# Altium schematic sheet Baseband.SchDoc
size B; SheetNumber: 2; SheetTotal: 5
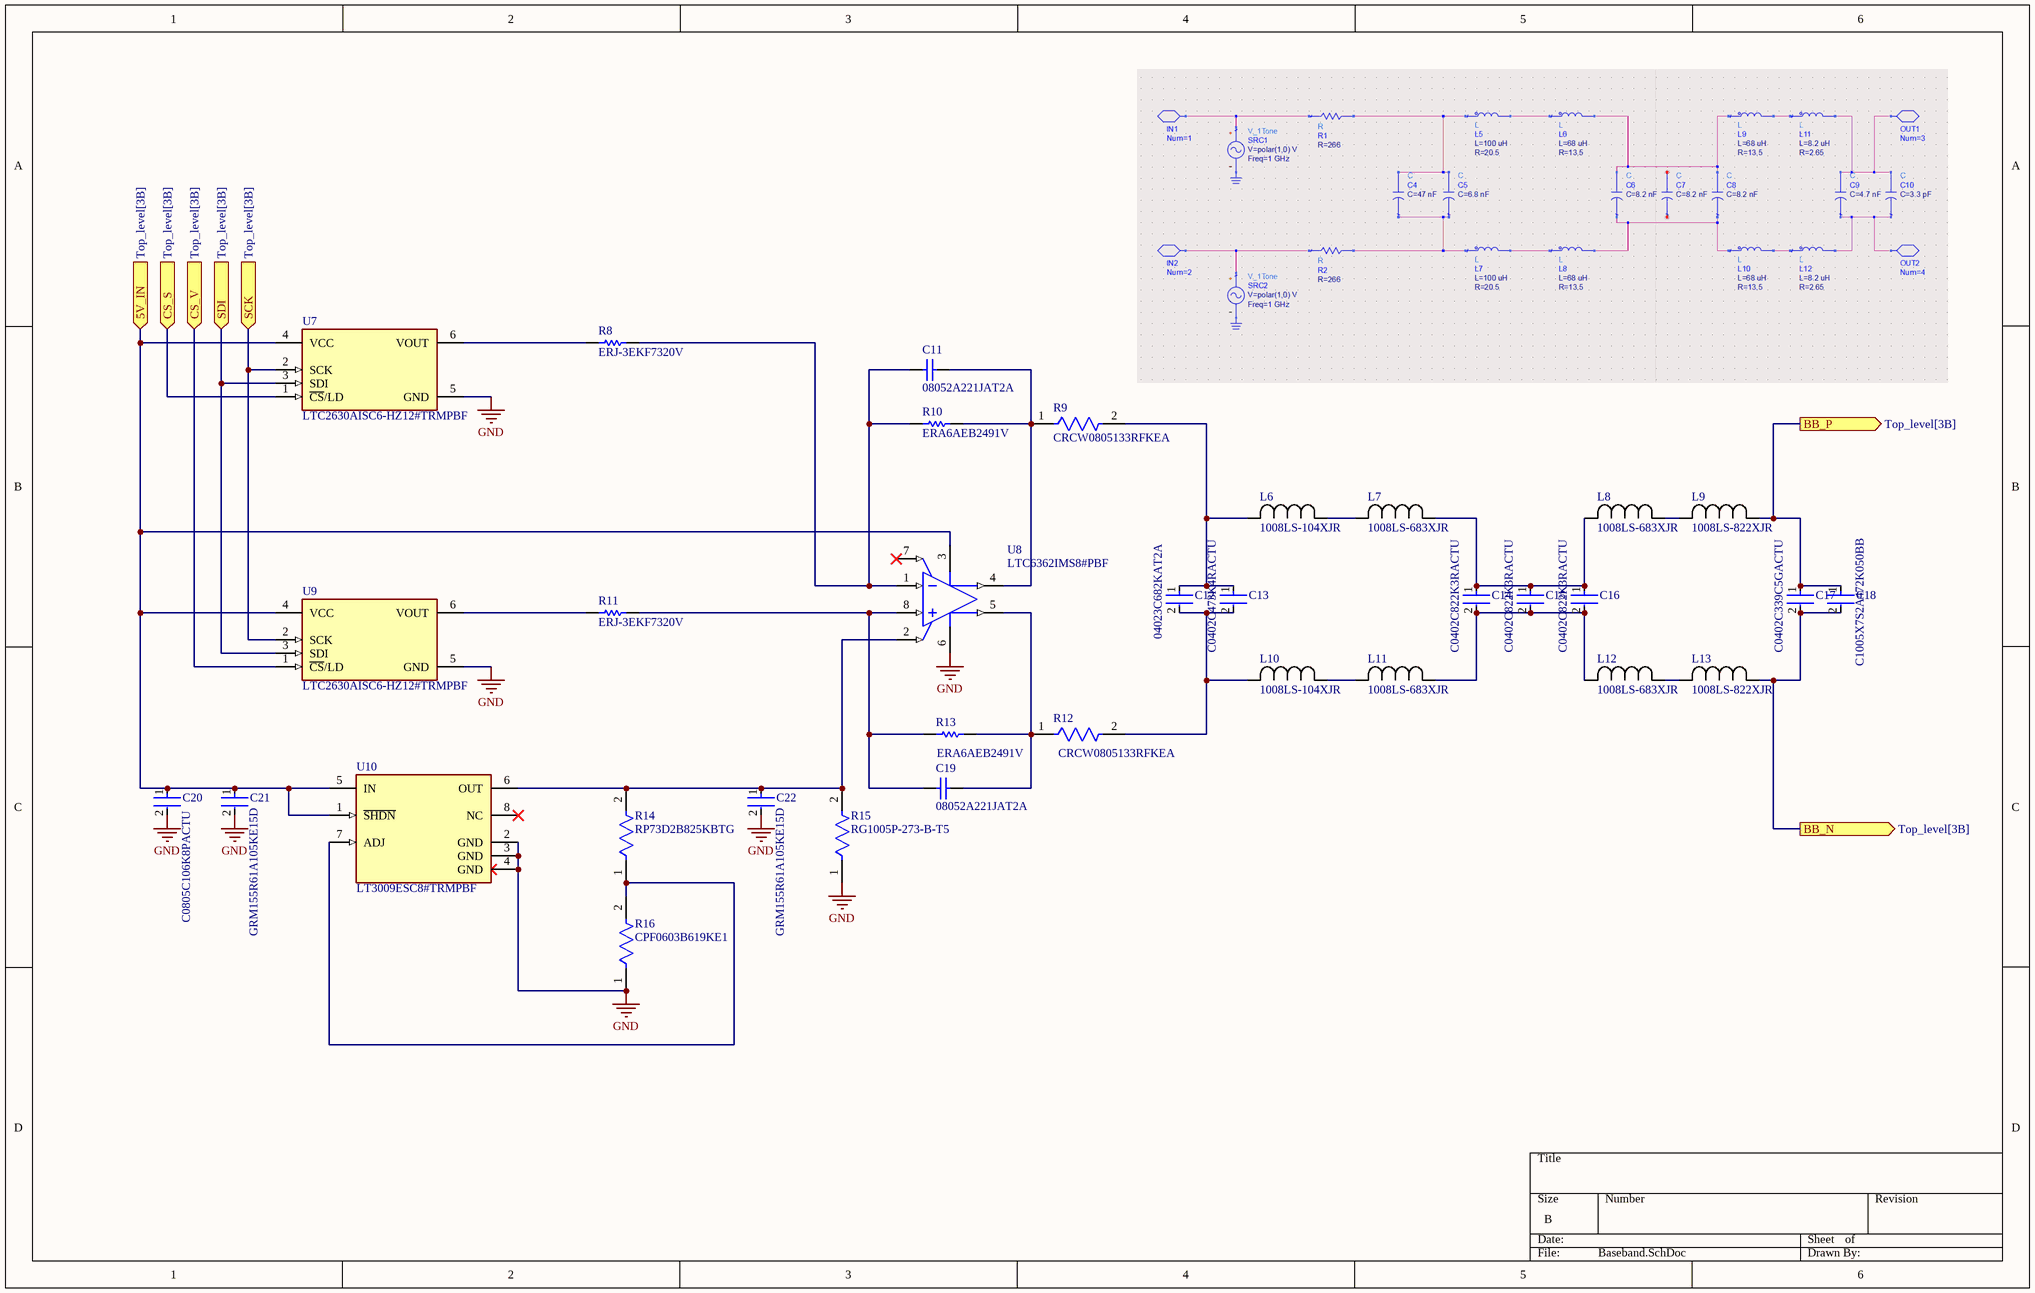
[diagram p0: Baseband.SchDoc]

## Parts
C11  08052A221JAT2A  [CAPC2013X140X50LL20T25]
C12  04023C682KAT2A  [FP-0402-L_1_0_1-W_0_5_0_1-IPC_A]
C13  C0402C473K4RACTU  [FP-C0402-BB-MFG]
C14  C0402C822K3RACTU  [FP-C0402-BB-MFG]
C15  C0402C822K3RACTU  [FP-C0402-BB-MFG]
C16  C0402C822K3RACTU  [FP-C0402-BB-MFG]
C17  C1005X7S2A472K050BB  [FP-C1005-050-0_05-IPC_C]
C18  C0402C339C5GACTU  [FP-C0402-BB-MFG]
C19  08052A221JAT2A  [CAPC2013X140X50LL20T25]
C20  C0805C106K8PACTU  [FP-C0805C-DG-MFG]
C21  GRM155R61A105KE15D  [FP-GRM15-0_1-MFG]
C22  GRM155R61A105KE15D  [FP-GRM15-0_1-MFG]
L6  1008LS-104XJR  [IND_1008LS]
L7  1008LS-683XJR  [IND_1008LS]
L8  1008LS-683XJR  [IND_1008LS]
L9  1008LS-822XJR  [IND_1008LS]
L10  1008LS-104XJR  [IND_1008LS]
L11  1008LS-683XJR  [IND_1008LS]
L12  1008LS-683XJR  [IND_1008LS]
L13  1008LS-822XJR  [IND_1008LS]
R8  ERJ-3EKF7320V  [RESC1608X55X30LL15T15]
R9  CRCW0805133RFKEA  [FP-CRCW0805-e3-IPC_C]
R10  ERA6AEB2491V  [RESC2013X60X40LL20T25]
R11  ERJ-3EKF7320V  [RESC1608X55X30LL15T15]
R12  CRCW0805133RFKEA  [FP-CRCW0805-e3-IPC_C]
R13  ERA6AEB2491V  [RESC2013X60X40LL20T25]
R14  RP73D2B825KBTG  [FP-RP732B-MFG]
R15  RG1005P-273-B-T5  [FP-RG1005-IPC_B]
R16  CPF0603B619KE1  [FP-CPF0603-MFG]
U7  LTC2630AISC6-HZ12#TRMPBF  [FP-SC6-6-05-08-1638-IPC_A]
U8  LTC6362IMS8#PBF  [LT-MS8-8_L]
U9  LTC2630AISC6-HZ12#TRMPBF  [FP-SC6-6-05-08-1638-IPC_A]
U10  LT3009ESC8#TRMPBF  [FP-SC8-8-05-08-1639-MFG]

## Ports
5V_IN (in, see Top_level[3B]), BB_N (out, see Top_level[3B]), BB_P (out, see Top_level[3B]), CS_S (in, see Top_level[3B]), CS_V (in, see Top_level[3B]), SCK (in, see Top_level[3B]), SDI (in, see Top_level[3B])

## Nets
GND: C20.2 C21.2 C22.2 R15.1 R16.1 U7.5(GND) U8.6(V-) U9.5(GND) U10.2(GND) U10.3(GND) U10.4(GND)
5V_IN: C20.1 C21.1 U7.4(VCC) U8.3(V+) U9.4(VCC) U10.1(~{SHDN}) U10.5(IN) ; port 5V_IN
BB_N: C17.2 C18.2 L13.1 ; port BB_N
BB_P: C17.1 C18.1 L9.1 ; port BB_P
CS_S: U7.1(~{CS}/LD) ; port CS_S
CS_V: U9.1(~{CS}/LD) ; port CS_V
SCK: U7.2(SCK) U9.2(SCK) ; port SCK
SDI: U7.3(SDI) U9.3(SDI) ; port SDI
NetC11_1: C11.1 R8.2 R10.1 U8.1(-IN)
NetC11_2: C11.2 R9.1 R10.2 U8.4(+OUT)
NetC12_1: C12.1 C13.1 L6.2 R9.2
NetC12_2: C12.2 C13.2 L10.2 R12.2
NetC14_1: C14.1 C15.1 C16.1 L7.1 L8.2
NetC14_2: C14.2 C15.2 C16.2 L11.1 L12.2
NetC19_1: C19.1 R11.2 R13.1 U8.8(+IN)
NetC19_2: C19.2 R12.1 R13.2 U8.5(-OUT)
NetC22_1: C22.1 R14.2 R15.2 U8.2(VOCM) U10.6(OUT)
NetL6_1: L6.1 L7.2
NetL8_1: L8.1 L9.2
NetL10_1: L10.1 L11.2
NetL12_1: L12.1 L13.2
NetR8_1: R8.1 U7.6(VOUT)
NetR11_1: R11.1 U9.6(VOUT)
NetR14_1: R14.1 R16.2 U10.7(ADJ)

Not connected (* = marked no-connect by the designer): U8 7(~{SHDN})*; U10 8(NC)*

## Library data of the parts
C11 C19 = CMP-2007-04587-1: Manufacturer: AVX Interconnect / Elco; Part Number: 08052A221JAT2A
C12 = CMP-2008-02545-2: General Purpose Ceramic Capacitor, 0402, 6.8nF, 10%, X7R, 15%, 25V; Height: 0.56mm; RoHS Compliant: Yes; Case Code (Metric): 1005; Lead Free: Lead Free; Width: 0.5mm; Weight: 2.3E-05oz; Series: -; Package Quantity: 1; Case Code (Imperial): 0402; Min Operating Temperature: -55°C; Max Operating Temperature: 125°C; Depth: 0.5mm; Tolerance: 10%; Voltage Rating (DC): 25V; Voltage: 25V; Packaging: Tape and Reel; REACH SVHC: No SVHC; Mount: Surface Mount; Case/Package: 0402; Thickness: 0.022inch; Dielectric: X7R; Termination: SMD/SMT; Number of Pins: 2; Construction: Flat; Radiation Hardening: No; Length: 1mm; Capacitance: 6.8nF; Voltage Rating: 25V
C13 = CMP-2008-03221-2: Cap Ceramic 0.047uF 16V X7R 10% SMD 0402 125°C Paper T/R; Manufacturer: Kemet; Tolerance: 0.1; Value: 47,000 pF; Temperature Coefficient: 15%; Material: Ceramic; Mouser Description: Multilayer Ceramic Capacitors MLCC - SMD/SMT 16volts 47000pF X7R 10%; ComponentLink2Description: Datasheet; Temperature Characteristic: X7R; Automotive: No; Package: C0402-BB; Height: 0.55mm; Manufacturer Part Number: C0402C473K4RACTU; Ipc Land Pattern Name: CAPC10050X50; Temperature: -55°C to +125°C; ComponentLink2URL: https://content.kemet.com/datasheets/KEM_C1002_X7R_SMD.pdf; RoHS: TRUE; Capacitance: 47,000 pF; Temperature Range High: +125°C; Digikey Description: Cap Ceramic 0.047uF 16V X7R 10% SMD 0402 125°C Paper T/R; Octopart: https://octopart.com/c0402c473k4ractu-kemet-145703; Lead Free: Yes; Device Class L2: Capacitors; Voltage Rating: 16 V; Temperature Range Low: -55°C; Device Class L1: Passive Components; Category: Cap; Device Class L3: Ceramic Capacitors
C14-C16 = CMP-2008-03260-2: CAP CER 8200PF 25V X7R 0402; Manufacturer: Kemet; Tolerance: 0.1; Capacitance: 8,200 pF; Material: Ceramic; Temperature Coefficient: 15%; Value: 8,200 pF; Lead Free: Yes; Device Class L3: Ceramic Capacitors; Digikey Description: CAP CER 8200PF 25V X7R 0402; Temperature Characteristic: X7R; Automotive: No; Temperature Range Low: -55°C; Manufacturer Part Number: C0402C822K3RACTU; Device Class L2: Capacitors; ComponentLink2Description: Datasheet; Temperature Range High: +125°C; Voltage Rating: 25 V; Device Class L1: Passive Components; Ipc Land Pattern Name: CAPC10050X50; Temperature: -55°C to +125°C; RoHS: TRUE; Package: C0402-BB; ComponentLink2URL: https://content.kemet.com/datasheets/KEM_C1002_X7R_SMD.pdf; Mouser Description: Multilayer Ceramic Capacitors MLCC - SMD/SMT 25volts 8200pF X7R 10%; Category: Cap; Octopart: https://octopart.com/c0402c822k3ractu-kemet-140357; Height: 0.55mm
C17 = CMP-08246-003235-1: Multilayer Ceramic Capacitors 4.7nF ±10% 100V X7S SMD 0402; Case Code (Imperial): 0402; RoHS Compliant: Yes; Capacitance: 4.7nF; Min Operating Temperature: -55°C; Voltage Rating (DC): 100V; Thickness: 0.022inch; Case Code (Metric): 1005; Height: 0.5mm; Tolerance: 10%; Termination: SMD/SMT; Width: 0.02inch; Voltage Rating: 100V; Dielectric: X7S; Case/Package: 0402; Resistor Type: Ceramic; Max Operating Temperature: 125°C; Mount: Surface Mount; Packaging: Tape and Reel; Length: 1mm; Package Quantity: 1; Weight: 2.3E-05oz; Series: C; Lead Free: Lead Free; Depth: 0.5mm
C18 = CMP-2008-03312-2: Capacitor: ceramic; MLCC; 3.3pF; 50VDC; C0G; ±0.25pF; SMD; 0402; Manufacturer: Kemet; Temperature Coefficient: 15%; Voltage Rating: 50 V; RoHS: TRUE; Material: Ceramic; Capacitance: 3.3 pF; Value: 3.3 pF; Height: 0.55mm; Manufacturer Part Number: C0402C339C5GACTU; Temperature: -55°C to +125°C; Package: C0402-BB; Mouser Description: Multilayer Ceramic Capacitors MLCC - SMD/SMT 50volts 3.3pF C0G .25pF; Category: Cap; ComponentLink2Description: Datasheet; Device Class L1: Passive Components; Tolerance: 0.25 pF; Temperature Characteristic: C0G; ComponentLink2URL: https://content.kemet.com/datasheets/KEM_C1002_X7R_SMD.pdf; Device Class L2: Capacitors; Temperature Range High: +125°C; Digikey Description: Capacitor: ceramic; MLCC; 3.3pF; 50VDC; C0G; ±0.25pF; SMD; 0402; Lead Free: Yes; Ipc Land Pattern Name: CAPC10050X50; Octopart: https://octopart.com/c0402c339c5gactu-kemet-105751; Automotive: No; Device Class L3: Ceramic Capacitors; Temperature Range Low: -55°C
C20 = CMP-2007-03243-2: CAP CER 10UF 10V X5R 0805; Manufacturer: Kemet; 3DS Part Number: 220-00001; Tolerance: 10%; Temperature Coefficient: 15%; Material: Ceramic; Device Class L2: Capacitors; Device Class L1: Passive Components; ComponentLink2URL: https://content.kemet.com/datasheets/KEM_C1006_X5R_SMD.pdf; Height: 1.4mm; Lead Free: Yes; Manufacturer Part Number: C0805C106K8PACTU; Digikey Description: CAP CER 10UF 10V X5R 0805; Octopart: https://octopart.com/c0805c106k8pactu-kemet-98697; Capacitance: 10uF; Value: 10uF; Temperature Range Low: -55°C; Temperature: -55°C to +85°C; Automotive: No; Mouser Description: CAP CER 10UF 10V X5R 0805; Ipc Land Pattern Name: CAPC200125X125; Temperature Range High: +85°C; Voltage: 10V; RoHS: TRUE; Device Class L3: Ceramic Capacitors; ComponentLink2Description: Datasheet; Voltage Rating: 10V; Package: C0805C-DG; Temperature Characteristic: X5R; Category: Cap
C21 C22 = CMP-2008-04556-2: CAP CER 1UF 10V X5R 0402; Manufacturer: Murata; Material: Ceramic; Tolerance: 10%; Temperature Coefficient: 15%; Octopart: https://octopart.com/grm155r61a105ke15d-murata-197442; Manufacturer Part Number: GRM155R61A105KE15D; Lead Free: Yes; ComponentLink2Description: Datasheet; Temperature: -55°C to +85°C; Temperature Range High: +85°C; Height: 0.55mm; Capacitance: 1uF; Ipc Land Pattern Name: CAPC10050X50; ComponentLink2URL: https://search.murata.co.jp/Ceramy/image/img/A01X/G101/ENG/GRM155R61A105KE15-01A.pdf; Temperature Range Low: -55°C; Device Class L2: Capacitors; Voltage Rating: 10V; RoHS: TRUE; Device Class L1: Passive Components; Device Class L3: Ceramic Capacitors; Temperature Characteristic: X5R; Mouser Description: 0402 1 uF 10 V ±10% Tolerance X5R Surface Mount Multilayer Ceramic Capacitor; Automotive: No; Package: GRM15-0.1; Digikey Description: CAP CER 1UF 10V X5R 0402; Value: 1uF; Category: Cap
L6-L13 = 1008LS-152XJLC: No Description Available; Mfr_Name: Coilcraft; Type: DEV; Copyright: Copyright (C) 2023 Ultra Librarian. All rights reserved.; Manufacturer_Part_Number: 1008LS-152XJLC; RefDes: RefDes
R8 R11 = CMP-2000-00632-1: Manufacturer: Panasonic; Part Number: ERJ-3EKF7320V
R9 R12 = CMP-1013-00410-3: RES Thick Film, 133Ω, 1%, 0.125W, 100ppm/°C, 0805; Voltage Rating: 150V; Max Power Dissipation: 125mW; Resistance: 133R; Width: 0.049inch; Length: 2mm; Termination: SMD/SMT; Package Quantity: 10; Depth: 1.25mm; Height: 0.45mm; Voltage Rating (DC): 150V; Number of Terminations: 2; Temperature Coefficient: 100ppm/°C; Lead Free: Lead Free; Min Operating Temperature: -55°C; Contact Plating: Tin; Features: Automotive AEC-Q200; Packaging: Tape and Reel; Max Operating Temperature: 155°C; Case/Package: 0805; Weight: 0.000194oz; Tolerance: 1%; Radiation Hardening: No; Power Rating: 125mW; Case Code (Metric): 2012; Composition: Thick Film; Case Code (Imperial): 0805
R10 R13 = CMP-2001-00781-1: Manufacturer: Panasonic; Part Number: ERA6AEB2491V
R14 = CMP-03211-008746-1: Res Thin Film 1206 825KΩ 0.1% 0.25W 15ppm/°C Molded SMD; Manufacturer: TE Connectivity; Voltage Rating: 200V; Temperature: -55°C to 155°C; Height: 0.65mm; packaging: 250 cut tape length; Temperature Range Low: -55°C; Package: RP732B; Temperature Range High: 155°C; Temperature Coefficient: 15ppm/°C; ComponentLink2URL: https://www.te.com/commerce/DocumentDelivery/DDEController?Action=showdoc&DocId=Data+Sheet%7F1773272%7FL%7Fpdf%7FEnglish%7FENG_DS_1773272_L.pdf%7F8-1879255-6; Tolerance: 0.1%; Resistance: 825KΩ; Octopart: https://octopart.com/rp73d2b825kbtg-te+connectivity-42012325; Automotive: No; Ipc Land Pattern Name: RESC305155X55; Device Class L2: Resistors; Power Rating: 0.25W; Category: Res; Manufacturer Part Number: RP73D2B825KBTG; octopart_url: https://octopart.com/rp73d2b825kbtg-te+connectivity-42012325; Device Class L1: Passive Components; Composition: Thin Film; RoHS: TRUE; Value: 825KΩ; Device Class L3: Chip SMD Resistors; Lead Free: Yes; ComponentLink2Description: Datasheet; Series: RP73
R15 = CMP-2002-01241-2: Automotive Metal Thin Film Chip Resistor, 0402, 27kΩ, 0.1%, 25ppm/°C, 0.0625W, 75V; Max Power Dissipation: 63mW; Voltage Rating: 25V; Power Rating: 30mW; Resistance: 27kR; Case Code (Imperial): 0402; Resistor Type: Thin Film; Length: 0.039inch; Tolerance: 0.1%; Packaging: Tape and Reel; Resistance Tolerance: 0.1%; Width: 0.02inch; Termination: SMD/SMT; Series: RG; Voltage Rating (DC): 25V; Temperature Coefficient: 25ppm/°C; RoHS Compliant: Yes; Height: 0.016inch; Number of Terminations: 2; Max Operating Temperature: 155°C; Package Quantity: 1; Features: Automotive AEC-Q200; Number of Pins: 2; Case/Package: 0402; Min Operating Temperature: -55°C; Lead Free: Lead Free; Case Code (Metric): 1005
R16 = CMP-03211-010478-1: RES SMD 619KΩ 0.1% 1/16W 0603; Manufacturer: TE Connectivity; Voltage Rating: 50V; Power Rating: 0.063W; Temperature Coefficient: 25ppm/°C; ComponentLink2Description: Datasheet; Category: Res; Temperature: -55°C to +155°C; Height: 0.55mm; octopart_url: https://octopart.com/cpf0603b619ke1-te+connectivity-76349732; Tolerance: 0.1%; Device Class L3: Chip SMD Resistors; Manufacturer Part Number: CPF0603B619KE1; Octopart: https://octopart.com/cpf0603b619ke1-te+connectivity-76349732; Device Class L1: Passive Components; Series: CPF; Temperature Range Low: -55°C; ComponentLink2URL: https://www.te.com/commerce/DocumentDelivery/DDEController?Action=showdoc&DocId=Data+Sheet%7F1773200%7FM%7Fpdf%7FEnglish%7FENG_DS_1773200_M.pdf%7F3-1676481-2; Automotive: No; packaging: 1k Reel; Package: CPF0603; Value: 619KΩ; Device Class L2: Resistors; Lead Free: Yes; Temperature Range High: +155°C; RoHS: TRUE; Ipc Land Pattern Name: RESC15580X45; Composition: Thin Film; Resistance: 619KΩ
U7 U9 = CMP-09082-000043-1: IC DAC 12BIT V-OUT SC70-6; Min Supply Voltage: 4.5V; Interface: SPI; Output Type: Voltage; Integral Nonlinearity (INL): 1LSB; Max Supply Voltage: 5.5V; Resolution: 12b; Number of Bits: 12; Operating Supply Voltage: 5V; Supply Type: Single; Number of Channels: 1; Settling Time: 4.4us; Min Operating Temperature: -40°C; Case/Package: SC; Package Quantity: 500; Packaging: Tape and Reel; Max Operating Temperature: 85°C; Mount: Surface Mount; Number of Pins: 6; RoHS Compliant: Yes; Number of Converters: 1
U8 = CMP-0359-00855-2: Single Channel, Precision, Low Power Differential Operational Amplifier / SAR ADC Driver, RRIO, 180 MHz Typical GBW, 45 V/us Typical SR, 2.8 to 5.25 V, 8-Pin SOP (MS8-8), Industrial, Pb-Free; Manufacturer: Linear Technology; Channels (#): 1; Vs Max (V): 5.25; Vos (mV) Typical: 0.05; GBW (MHz) Typical: 180; Is (mA) Typical: 0.9; SR (V/us) Typical: 45; Vs Min (V): 2.8; Type: DIFF; PackageReference: LT-MS8-8; ComponentLink1Description: Manufacturer URL; Mounting Technology: Surface Mount; PackageVersion: Rev G; RevisionNote: URLs updated; PartNumber: LTC6362IMS8#PBF; Linear Technology Part Number: LTC6362; ComponentLink3URL: http://cds.linear.com/docs/en/packaging/05081610_G_SO8.pdf; ComponentLink2URL: http://cds.linear.com/docs/en/datasheet/6362fa.pdf; ComponentLink2Description: Datasheet; PackageDescription: 8-Lead Plastic Small Outline, Body 3.9 x 4.9 mm, Pitch 1.27 mm; DatasheetVersion: Rev. A; RoHS: Pb-Free; ComponentLink3Description: Package Specification; ComponentLink1URL: http://www.linear.com/
U10 = CMP-0476-01730-2: IC REG LIN POS ADJ 20MA SC70-8; Number of Regulators: 1; Max Output Voltage: 19.5V; Output Voltage Accuracy: 2%; Power Supply Rejection Ratio (PSRR): 72dB; Min Current Limit: 22mA; Dropout Voltage: 280mV; Operating Supply Current: 3uA; Polarity: Positive; Max Input Voltage: 20V; Reference Voltage: 600mV; Min Input Voltage: 1.6V; Quiescent Current: 6uA; Output Type: Adjustable; Width: 1.35mm; Accuracy: 2%; Height: 1mm; Output Voltage: 19.5V; Min Operating Temperature: -40°C; Output Current: 20mA; Case/Package: SC; Max Operating Temperature: 125°C; Max Output Current: 20mA; Number of Outputs: 1; Series: -; RoHS Compliant: Yes; Min Output Voltage: 600mV; Package Quantity: 1; Number of Pins: 8; Length: 2.2mm; Packaging: Tape and Reel